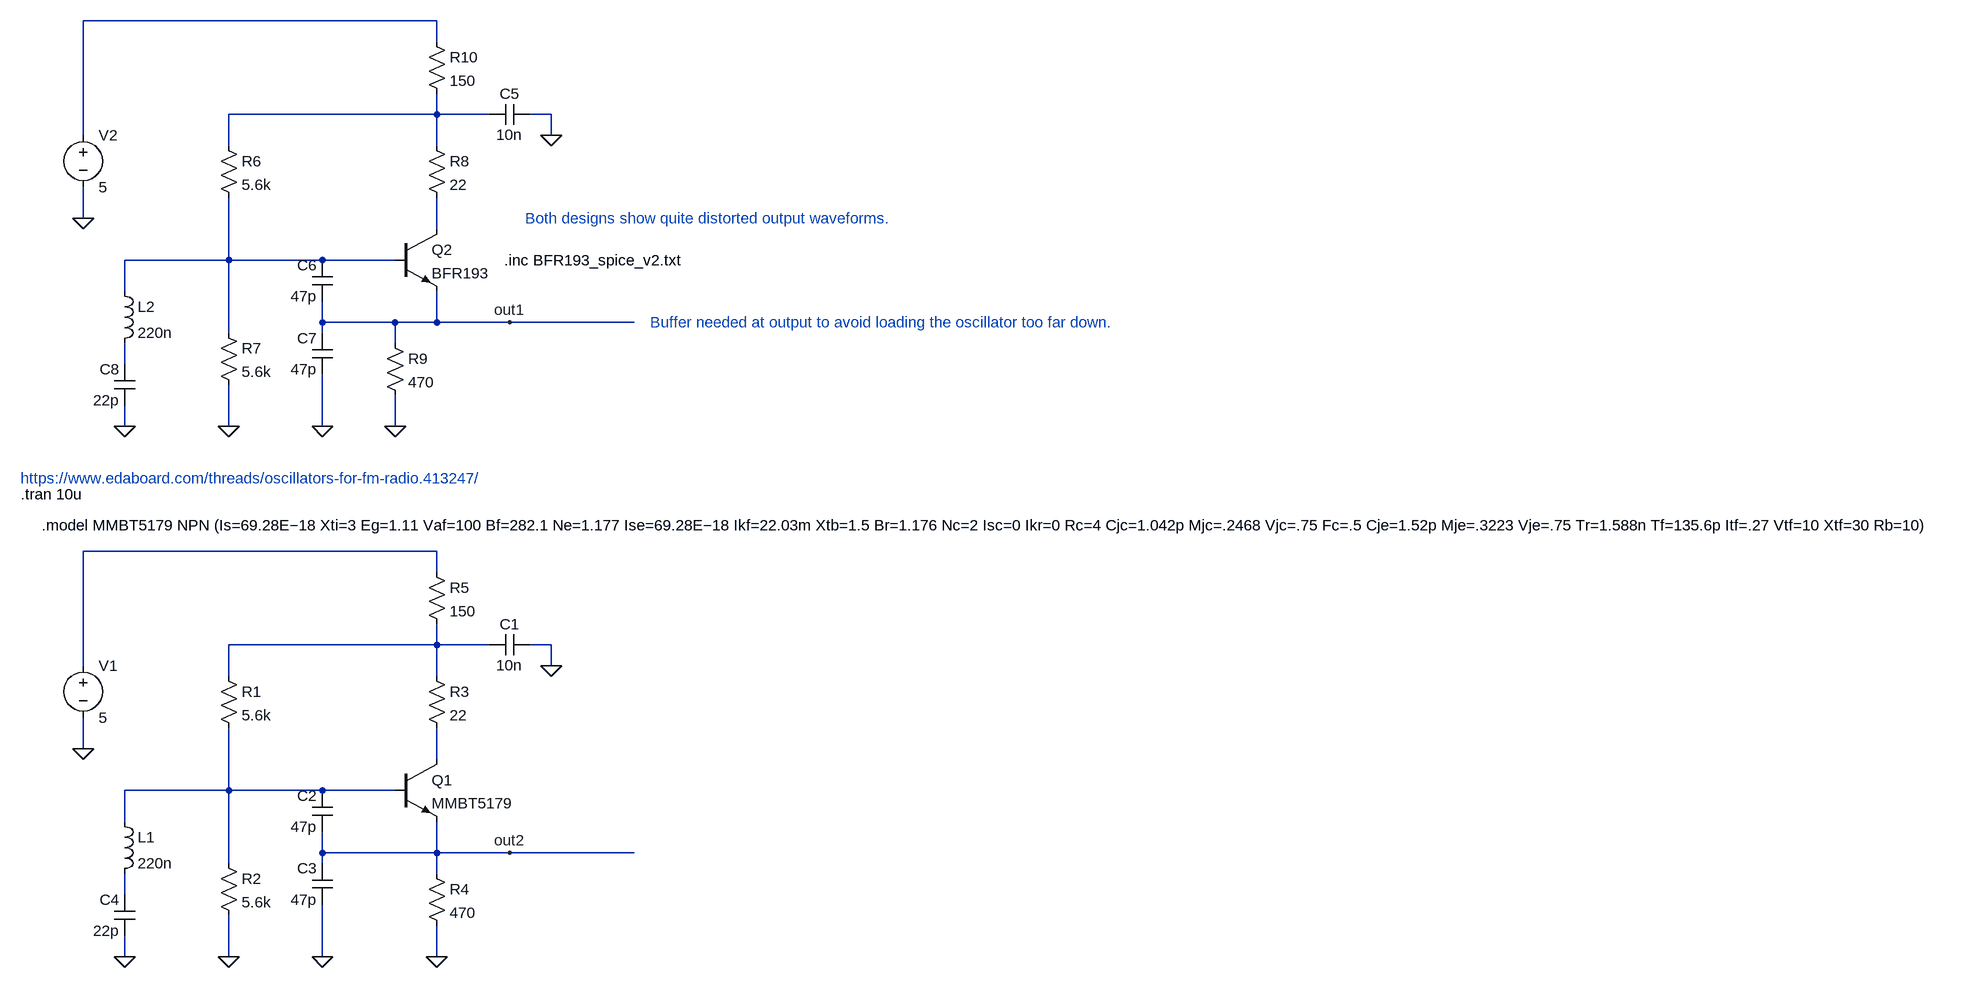
[diagram p0: schematic CC_Clapp_edaboard.asc]
CC_Clapp_edaboard.asc, the LTspice schematic file:
Version 4
SHEET 1 2200 1188
WIRE -624 -272 -1168 -272
WIRE -624 -240 -624 -272
WIRE -624 -128 -624 -160
WIRE -624 -128 -944 -128
WIRE -544 -128 -624 -128
WIRE -448 -128 -480 -128
WIRE -1168 -96 -1168 -272
WIRE -448 -96 -448 -128
WIRE -944 -80 -944 -128
WIRE -624 -80 -624 -128
WIRE -1168 32 -1168 -16
WIRE -624 48 -624 0
WIRE -944 96 -944 0
WIRE -944 96 -1104 96
WIRE -800 96 -944 96
WIRE -688 96 -800 96
WIRE -1104 144 -1104 96
WIRE -800 192 -800 160
WIRE -688 192 -800 192
WIRE -624 192 -624 144
WIRE -624 192 -688 192
WIRE -512 192 -624 192
WIRE -320 192 -512 192
WIRE -944 208 -944 96
WIRE -800 208 -800 192
WIRE -688 224 -688 192
WIRE -1104 256 -1104 224
WIRE -1104 352 -1104 320
WIRE -944 352 -944 288
WIRE -800 352 -800 272
WIRE -688 352 -688 304
WIRE -624 544 -1168 544
WIRE -624 576 -624 544
WIRE -624 688 -624 656
WIRE -624 688 -944 688
WIRE -544 688 -624 688
WIRE -448 688 -480 688
WIRE -1168 720 -1168 544
WIRE -448 720 -448 688
WIRE -944 736 -944 688
WIRE -624 736 -624 688
WIRE -1168 848 -1168 800
WIRE -624 864 -624 816
WIRE -944 912 -944 816
WIRE -944 912 -1104 912
WIRE -800 912 -944 912
WIRE -688 912 -800 912
WIRE -1104 960 -1104 912
WIRE -800 1008 -800 976
WIRE -624 1008 -624 960
WIRE -624 1008 -800 1008
WIRE -512 1008 -624 1008
WIRE -320 1008 -512 1008
WIRE -944 1024 -944 912
WIRE -800 1024 -800 1008
WIRE -624 1040 -624 1008
WIRE -1104 1072 -1104 1040
WIRE -1104 1168 -1104 1136
WIRE -944 1168 -944 1104
WIRE -800 1168 -800 1088
WIRE -624 1168 -624 1120
FLAG -1168 32 0
FLAG -1104 352 0
FLAG -944 352 0
FLAG -800 352 0
FLAG -688 352 0
FLAG -448 -96 0
FLAG -512 192 out1
FLAG -1168 848 0
FLAG -1104 1168 0
FLAG -944 1168 0
FLAG -800 1168 0
FLAG -624 1168 0
FLAG -448 720 0
FLAG -512 1008 out2
DATAFLAG -1040 96 ""
DATAFLAG -720 192 ""
DATAFLAG -1040 912 ""
DATAFLAG -704 1008 ""
DATAFLAG -832 688 ""
DATAFLAG -800 -128 ""
SYMBOL voltage -1168 -112 R0
SYMATTR InstName V2
SYMATTR Value 5
SYMBOL res -960 -96 R0
SYMATTR InstName R6
SYMATTR Value 5.6k
SYMBOL res -960 192 R0
SYMATTR InstName R7
SYMATTR Value 5.6k
SYMBOL res -640 -96 R0
SYMATTR InstName R8
SYMATTR Value 22
SYMBOL res -704 208 R0
SYMATTR InstName R9
SYMATTR Value 470
SYMBOL res -640 -256 R0
SYMATTR InstName R10
SYMATTR Value 150
SYMBOL cap -480 -144 R90
WINDOW 0 0 32 VBottom 2
WINDOW 3 32 32 VTop 2
SYMATTR InstName C5
SYMATTR Value 10n
SYMBOL cap -784 160 R180
WINDOW 0 24 56 Left 2
WINDOW 3 24 8 Left 2
SYMATTR InstName C6
SYMATTR Value 47p
SYMBOL cap -784 272 R180
WINDOW 0 24 56 Left 2
WINDOW 3 24 8 Left 2
SYMATTR InstName C7
SYMATTR Value 47p
SYMBOL cap -1088 320 R180
WINDOW 0 24 56 Left 2
WINDOW 3 24 8 Left 2
SYMATTR InstName C8
SYMATTR Value 22p
SYMBOL ind -1120 128 R0
SYMATTR InstName L2
SYMATTR Value 220n
SYMBOL voltage -1168 704 R0
SYMATTR InstName V1
SYMATTR Value 5
SYMBOL res -960 720 R0
SYMATTR InstName R1
SYMATTR Value 5.6k
SYMBOL res -960 1008 R0
SYMATTR InstName R2
SYMATTR Value 5.6k
SYMBOL res -640 720 R0
SYMATTR InstName R3
SYMATTR Value 22
SYMBOL res -640 1024 R0
SYMATTR InstName R4
SYMATTR Value 470
SYMBOL res -640 560 R0
SYMATTR InstName R5
SYMATTR Value 150
SYMBOL cap -480 672 R90
WINDOW 0 0 32 VBottom 2
WINDOW 3 32 32 VTop 2
SYMATTR InstName C1
SYMATTR Value 10n
SYMBOL cap -784 976 R180
WINDOW 0 24 56 Left 2
WINDOW 3 24 8 Left 2
SYMATTR InstName C2
SYMATTR Value 47p
SYMBOL cap -784 1088 R180
WINDOW 0 24 56 Left 2
WINDOW 3 24 8 Left 2
SYMATTR InstName C3
SYMATTR Value 47p
SYMBOL cap -1088 1136 R180
WINDOW 0 24 56 Left 2
WINDOW 3 24 8 Left 2
SYMATTR InstName C4
SYMATTR Value 22p
SYMBOL ind -1120 944 R0
SYMATTR InstName L1
SYMATTR Value 220n
SYMBOL npn -688 864 R0
SYMATTR InstName Q1
SYMATTR Value MMBT5179
SYMBOL npn -688 48 R0
SYMATTR InstName Q2
SYMATTR Value BFR193
TEXT -1264 432 Left 2 ;https://www.edaboard.com/threads/oscillators-for-fm-radio.413247/
TEXT -1264 456 Left 2 !.tran 10u
TEXT -296 192 Left 2 ;Buffer needed at output to avoid loading the oscillator too far down.
TEXT -1232 504 Left 2 !.model MMBT5179 NPN (Is=69.28E−18 Xti=3 Eg=1.11 Vaf=100 Bf=282.1 Ne=1.177 Ise=69.28E−18 Ikf=22.03m Xtb=1.5 Br=1.176 Nc=2 Isc=0 Ikr=0 Rc=4 Cjc=1.042p Mjc=.2468 Vjc=.75 Fc=.5 Cje=1.52p Mje=.3223 Vje=.75 Tr=1.588n Tf=135.6p Itf=.27 Vtf=10 Xtf=30 Rb=10)
TEXT -520 96 Left 2 !.inc BFR193_spice_v2.txt
TEXT -488 32 Left 2 ;Both designs show quite distorted output waveforms.

The netlist it stands for:
* CC_Clapp_edaboard.asc
V2 N001 0 5
R6 N002 N004 5.6k
R7 N004 0 5.6k
R8 N002 N003 22
R9 out1 0 470
R10 N001 N002 150
C5 0 N002 10n
C6 out1 N004 47p
C7 0 out1 47p
C8 0 N005 22p
L2 N004 N005 220n
V1 N006 0 5
R1 N007 N009 5.6k
R2 N009 0 5.6k
R3 N007 N008 22
R4 out2 0 470
R5 N006 N007 150
C1 0 N007 10n
C2 out2 N009 47p
C3 0 out2 47p
C4 0 N010 22p
L1 N009 N010 220n
Q1 N008 N009 out2 0 MMBT5179
Q2 N003 N004 out1 0 BFR193
.model NPN NPN
.model PNP PNP
.lib standard.bjt
* https://www.edaboard.com/threads/oscillators-for-fm-radio.413247/
.tran 10u
* Buffer needed at output to avoid loading the oscillator too far down.
.model MMBT5179 NPN (Is=69.28E−18 Xti=3 Eg=1.11 Vaf=100 Bf=282.1 Ne=1.177 Ise=69.28E−18 Ikf=22.03m Xtb=1.5 Br=1.176 Nc=2 Isc=0 Ikr=0 Rc=4 Cjc=1.042p Mjc=.2468 Vjc=.75 Fc=.5 Cje=1.52p Mje=.3223 Vje=.75 Tr=1.588n Tf=135.6p Itf=.27 Vtf=10 Xtf=30 Rb=10)
.inc BFR193_spice_v2.txt
* Both designs show quite distorted output waveforms.
.backanno
.end